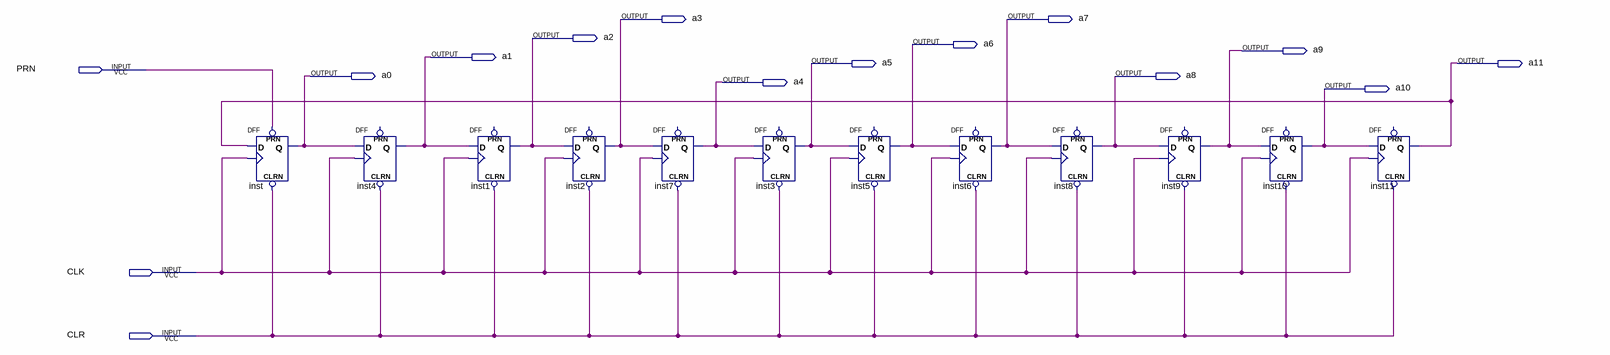
[diagram p0: schematic sheet]
// Quartus schematic yiwei.bdf as structural Verilog: 12 symbols, 15 pins
module yiwei (
  input  PRN,
  input  CLK,
  input  CLR,
  output a3,
  output a7,
  output a2,
  output a6,
  output a9,
  output a1,
  output a5,
  output a11,
  output a0,
  output a8,
  output a4,
  output a10
);

  DFF inst (.CLRN(CLR), .CLK(CLK), .D(a11), .PRN(PRN), .Q(a0));
  DFF inst4 (.CLRN(CLR), .CLK(CLK), .D(a0), .Q(a1));  // open: PRN
  DFF inst1 (.CLRN(CLR), .CLK(CLK), .D(a1), .Q(a2));  // open: PRN
  DFF inst2 (.CLRN(CLR), .CLK(CLK), .D(a2), .Q(a3));  // open: PRN
  DFF inst7 (.CLRN(CLR), .CLK(CLK), .D(a3), .Q(a4));  // open: PRN
  DFF inst3 (.CLRN(CLR), .CLK(CLK), .D(a4), .Q(a5));  // open: PRN
  DFF inst5 (.CLRN(CLR), .CLK(CLK), .D(a5), .Q(a6));  // open: PRN
  DFF inst6 (.CLRN(CLR), .CLK(CLK), .D(a6), .Q(a7));  // open: PRN
  DFF inst8 (.CLRN(CLR), .CLK(CLK), .D(a7), .Q(a8));  // open: PRN
  DFF inst9 (.CLRN(CLR), .CLK(CLK), .D(a8), .Q(a9));  // open: PRN
  DFF inst10 (.CLRN(CLR), .CLK(CLK), .D(a9), .Q(a10));  // open: PRN
  DFF inst11 (.CLRN(CLR), .CLK(CLK), .D(a10), .Q(a11));  // open: PRN
endmodule
